# EAGLE design IR_Interruptor board (EAGLE 9.6.2)
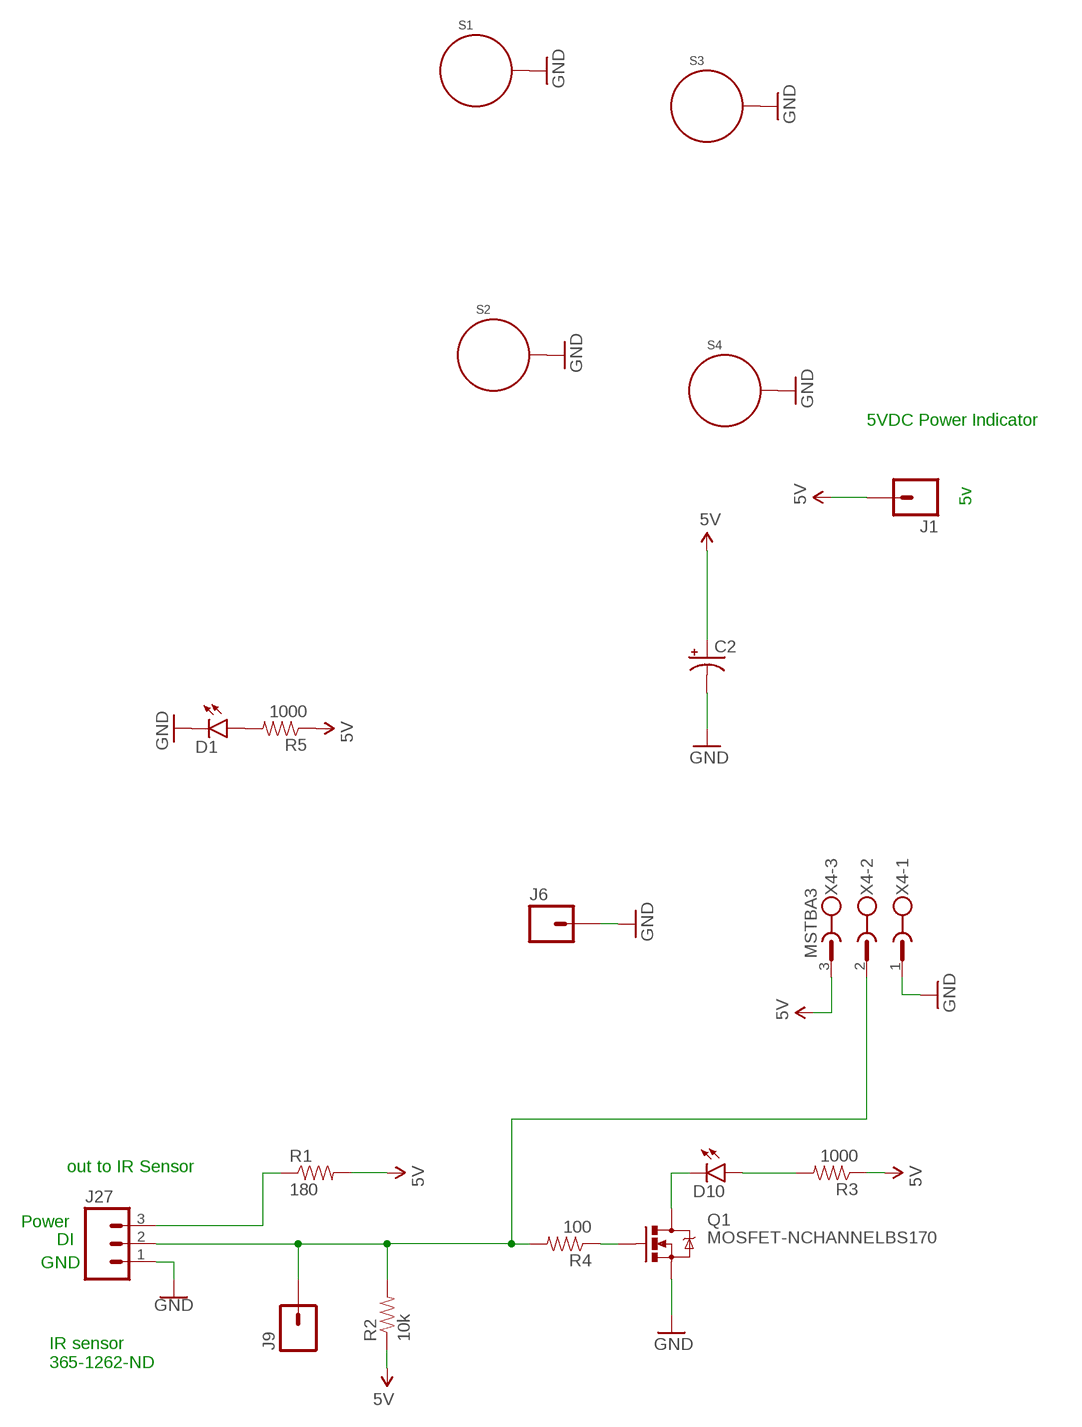
[diagram p0: schematic, sheet 1]

## Parts
C2  CAP_POLPTH2  [CPOL-RADIAL-10UF-25V]
D1  LED1206  [LED-1206]
D10  LED1206  [LED-1206]
J1  M01PTH  [1X01]
J6  M01PTH  [1X01]
J9  M01PTH  [1X01]
J27  M03SCREW  [SCREWTERMINAL-3.5MM-3]
Q1  MOSFET-NCHANNELBS170  [TO-92]
R1  180  RESISTOR0805-RES  [0805]
R2  10k  RESISTOR0805-RES  [0805]
R3  1000  RESISTOR0805-RES  [0805]
R4  100  RESISTOR0805-RES  [0805]
R5  1000  RESISTOR0805-RES  [0805]
S1  STANDOFF_ELECTRICAL  [STANDOFF-ELECTRICAL]
S2  STANDOFF_ELECTRICAL  [STANDOFF-ELECTRICAL]
S3  STANDOFF_ELECTRICAL  [STANDOFF-ELECTRICAL]
S4  STANDOFF_ELECTRICAL  [STANDOFF-ELECTRICAL]
X4  MSTBA3  [MSTBA3]

## Nets
5V [High Power]: C2.1(+) J1.1 R1.2 R2.1 R3.1 R5.1 X4.3
DO: J9.1 J27.2 R2.2 R4.2 X4.2
GND [High Power]: C2.2(-) D1.C J6.1 J27.1 Q1.3(S) S1.P1 S2.P1 S3.P1 S4.P1 X4.1
N$1: Q1.2(G) R4.1
N$2: D10.C Q1.1(D)
N$3: D1.A R5.2
N$4: D10.A R3.2
POWER [High Power]: J27.3 R1.1

## Notes on the sheet
- 5VDC Power Indicator
- 5v
- out to IR Sensor
- Power
- DI
- GND
- IR sensor
  365-1262-ND

## Library data of the parts
C2 = SparkFun-Passives:CAP_POL: Capacitor Polarized These are standard SMD and PTH capacitors. Normally 10uF, 47uF, and 100uF in electrolytic and tantalum varieties. Always verify the external diameter of the through hole cap, it varies with capacity, voltage, and manufacturer. The EIA devices should be standard.
D1 D10 = SparkFun-LED:LED: LEDs Standard schematic elements and footprints for 5mm, 3mm, 1206, and 0603 sized LEDs. 5mm - Spark Fun Electronics SKU : COM-00529 (and others)
J1 J6 J9 = SparkFun-Connectors:M01: Header 1 Standard 1-pin 0.1" header. Use with straight break away headers (SKU : PRT-00116), right angle break away headers (PRT-00553), swiss pins (PRT-00743), machine pins (PRT-00117), and female headers (PRT-00115). SMTSO-256-ET is a "flush mount" nut for a 4-40 screw. The older package used to be too tight, and did not allow it to sit properly thru the drill hit. The latest (0.165DIA) fits nice and snug.
J27 = SparkFun-Connectors:M03: Header 3 Standard 3-pin 0.1" header. Use with straight break away headers (SKU : PRT-00116), right angle break away headers (PRT-00553), swiss pins (PRT-00743), machine pins (PRT-00117), and female headers (PRT-00115). Molex polarized connector foot print use with SKU : PRT-08232 with associated crimp pins and housings.; PROD_ID: CONN-08288
Q1 = SparkFun-DiscreteSemi:MOSFET-NCHANNEL: Common NMOSFET Parts MFG P/N Store ID Prod ID FDD8780 TRANS-09984 SI7820DN TRANS-11055 FDS6630A IC-08089 2N7002PW TRANS-11151 FQP30N06L COM-10213 TRANS-10060 BSS123LT1G TRANS-08345 BSS138 TRANS-00830 BS170 2N7000
R1-R5 = SparkFun-Passives:RESISTOR: Resistor Basic schematic elements and footprints for 0603, 1206, and PTH resistors.
S1-S4 = th_libraries:STANDOFF_ELECTRICAL: A standoff intended to be an electrically connected point. Pad size and stop size allow for a #8 Phillips pan screw head to make a solid connection to the board.; SPICEPREFIX: X
X4 = con-phoenix-508:MSTBA3: PHOENIX; MF: FARNELL; MPN: 1757255; OC_FARNELL: 3705183; OC_NEWARK: 71C4162

## Net classes
1 High Power: width 0.406 mm, drill 0.483 mm
2 Low Power: width 0.305 mm, drill 0.483 mm

## Board
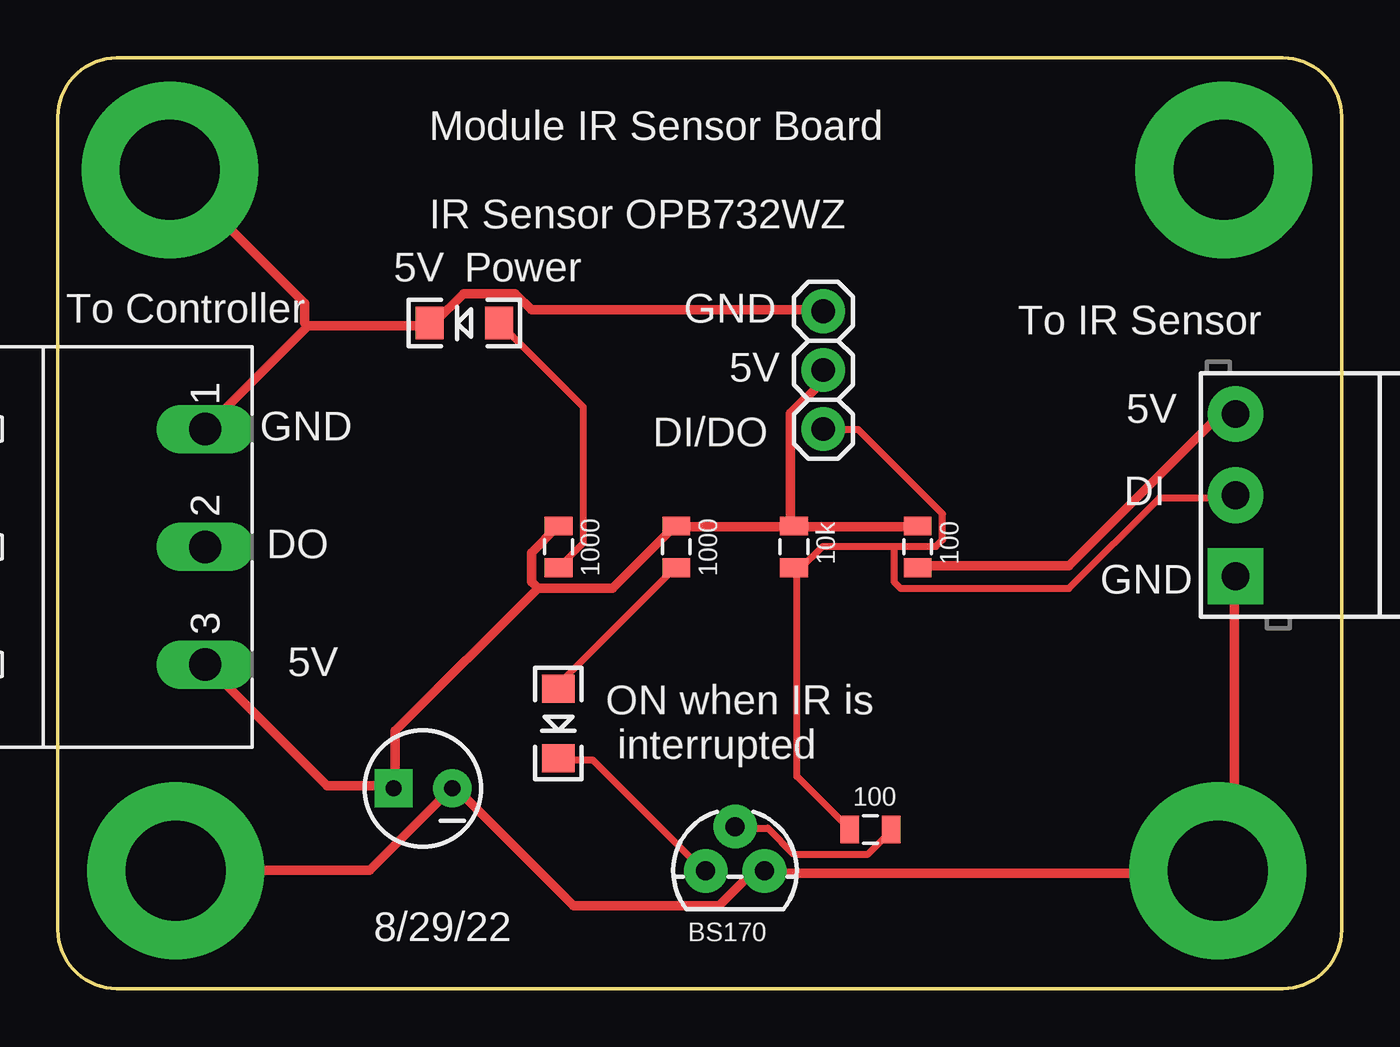
[diagram p1: board, top side]
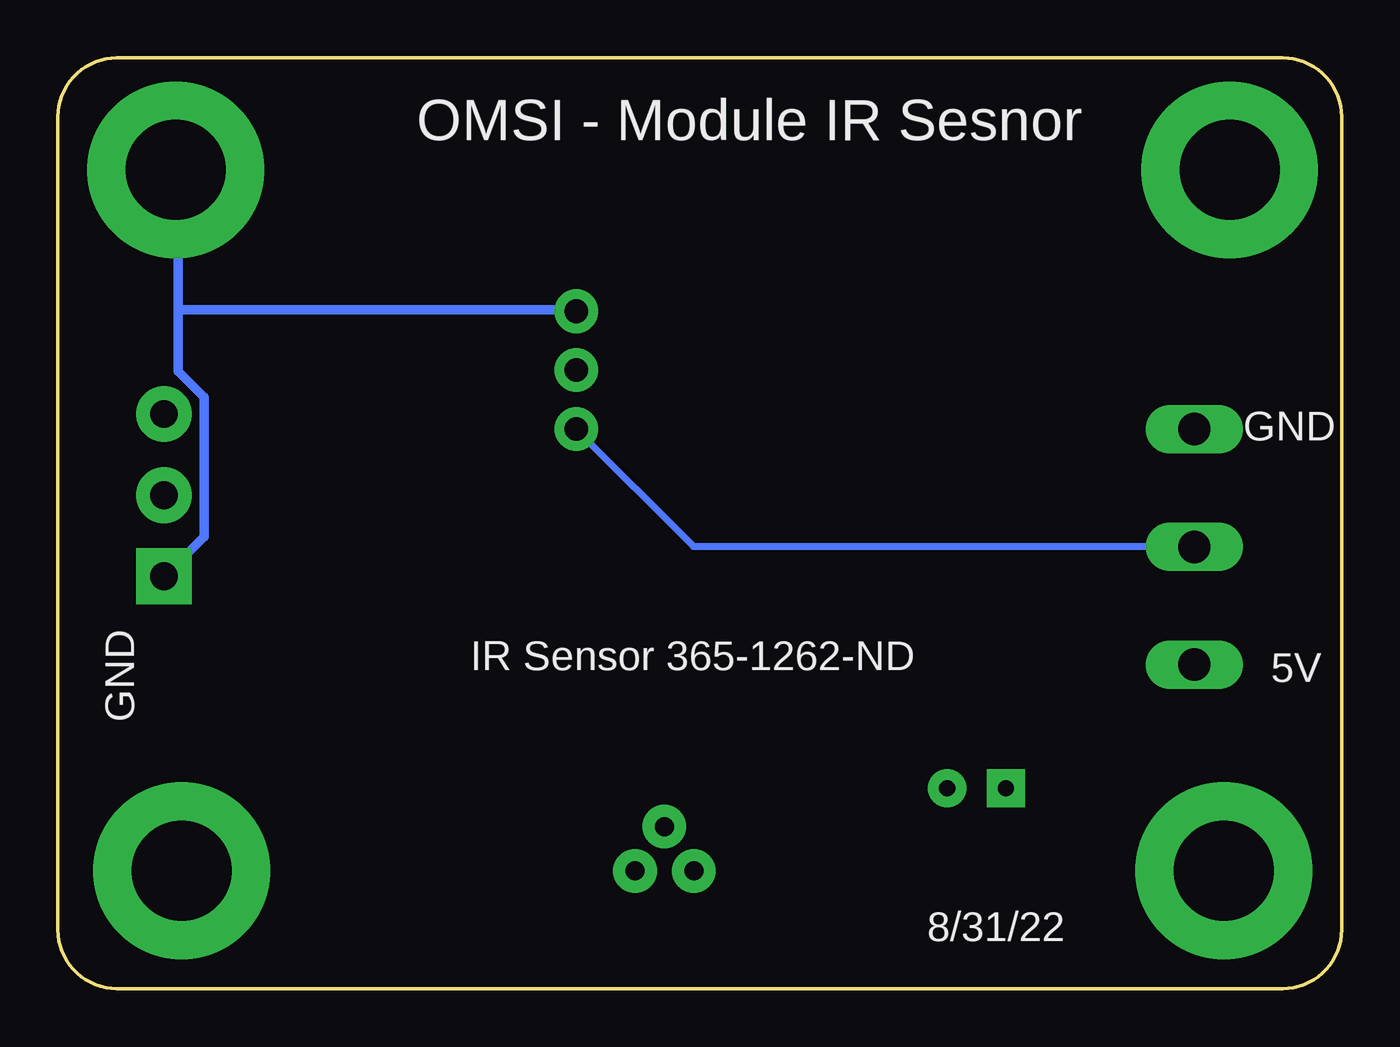
[diagram p2: board, bottom side, seen from below]

Size 55.37 x 40.13 mm. Coordinates in mm from the lower left corner, seen from the top.
Outline: 0,37.59 0,2.54 arc90 2.54,0 52.83,0 arc90 55.37,2.54 55.37,37.59 arc90 52.83,40.13 2.54,40.13 arc90 0,37.59
Copper layers (1*16): Top 0.035559375mm / dielectric 1.6mm / Bottom 0.035559375mm
Design rules "oshpark-2layer (1) *": minimum track width 12mil, minimum drill 10mil, track to track 10mil, track to pad 10mil, pad to pad 10mil, via to via 10mil, smd to smd 10mil, copper to edge 10mil, drill to drill 6mil, minimum pad ring 5mil, minimum via ring 5mil, stop-mask expansion 2.5mil, vias tented up to drill 25mil, thermal gap 10mil

### Footprints (pad centres in the part's own frame; a part is rotated, then mirrored left to right if it is on the bottom)
CPOL-RADIAL-10UF-25V = drill 0.7 pad 1.651 square: 1 1.27,0 | drill 0.7 pad 1.651: 2 -1.27,0
LED-1206 = smd 1.2 x 1.4: A -1.5,0; C 1.5,0
1X01 = drill 1.016 pad 1.88: 1 0,0
SCREWTERMINAL-3.5MM-3 = drill 1.2 pad 2.413 square: 1 0,0 | drill 1.2 pad 2.413: 2 3.5,0; 3 7,0
TO-92 = drill 0.813 pad 1.88: 1 -1.27,0; 2 0,1.905; 3 1.27,0
0805 = smd 0.8 x 1.2: 1 -0.9,0; 2 0.9,0
STANDOFF-ELECTRICAL = drill 4.318 pad 7.62: P1 0,0
MSTBA3 = drill 1.397 long: 1 -5.08,5.08; 2 0,5.08; 3 5.08,5.08

### Placement (x,y rotation side)
C2  15.75,8.64 180 top
D1  17.53,28.7 180 top
D10  21.59,11.43 270 top
J1  33.02,26.67 180 top
J6  33.02,29.21 0 top
J9  33.02,24.13 180 top
J27  50.8,17.78 90 top
Q1  29.21,5.08 0 top
R1  37.08,19.05 90 top
R2  31.75,19.05 270 top
R3  26.67,19.05 270 top
R4  35.05,6.86 180 top
R5  21.59,19.05 270 top
S1  4.83,35.31 0 top
S2  5.08,5.08 0 top
S3  50.04,5.08 0 top
S4  50.29,35.31 0 top
X4  1.27,19.05 270 top

### Tracks (layer width: path | path; a pad name or v marks a point on that pad's centre or on a via)
5V
  Top 0.406: X4.3 6.45,13.91 11.62,8.74 14.41,8.74 C2.1 14.55,8.88 14.55,11.11 20.7,17.26 | 20.7,17.26 20.42,17.54 20.42,18.8 21.54,19.91 R5.1 | 20.7,17.26 23.91,17.26 26.57,19.91 R3.1 26.85,19.91 31.74,19.91 R2.1 | R1.2 37.05,19.91 31.88,19.91 R2.1 | J1.1 32.99,26.62 32.99,26.2 31.6,24.8 31.6,20.05 R2.1
DO
  Top 0.305: R4.2 34.11,6.92 31.88,9.16 31.88,18.1 R2.2 32.02,18.1 32.99,19.08 36.07,19.08 | 36.07,19.08 37.88,19.08 38.16,19.35 38.16,20.47 34.53,24.1 33.13,24.1 J9.1 | 36.07,19.08 36.07,17.54 36.35,17.26 43.61,17.26 47.52,21.17 50.74,21.17 J27.2
  Bottom 0.305: J9.1 27.97,19.08 6.45,19.08 X4.2
GND
  Top 0.406: 10.78,28.58 15.95,28.58 D1.C 16.23,28.71 17.49,29.97 19.72,29.97 20.42,29.27 32.99,29.27 J6.1 | 10.78,28.58 6.45,24.24 X4.1 | 10.78,28.58 10.64,28.71 10.64,29.55 4.91,35.28 S1.P1 | S2.P1 5.19,5.11 13.44,5.11 16.93,8.6 C2.2 17.21,8.6 22.24,3.57 28.52,3.57 29.92,4.97 30.48,4.97 Q1.3 30.62,4.97 49.9,4.97 S3.P1 50.04,5.11 50.74,5.8 50.74,17.68 J27.1
  Bottom 0.406: 50.18,29.27 50.18,26.62 49.06,25.5 49.06,19.49 50.74,17.82 J27.1 | 50.18,29.27 50.18,35.28 S4.P1 | 50.18,29.27 33.13,29.27 J6.1
N$1
  Top 0.305: R4.1 35.93,6.78 34.95,5.8 31.74,5.8 30.62,6.92 29.22,6.92 Q1.2
N$2
  Top 0.305: D10.C 21.68,9.86 23.08,9.86 27.83,5.11 Q1.1
N$3
  Top 0.305: R5.2 21.68,18.24 22.66,19.21 22.66,25.08 19.16,28.58 D1.A
N$4
  Top 0.305: R3.2 26.57,18.1 21.54,13.07 D10.A
POWER
  Top 0.406: R1.1 37.19,18.24 43.61,18.24 50.04,24.66 50.74,24.66 J27.3

### Text on the board
tPlace: Module IR Sensor Board | IR Sensor OPB732WZ | 5V | Power | To Controller | GND | To IR Sensor | 5V | 5V | GND | DI/DO | DI | DO | 10k | 100 | 1000 | 1000 | GND | 5V | ON when IR is / interrupted | 100 | 8/29/22 | BS170
bPlace: OMSI - Module IR Sesnor | GND | GND | 5V | IR Sensor 365-1262-ND | 8/31/22